# EAGLE schematic powerbox schematic v13 (EAGLE 9.7.0)
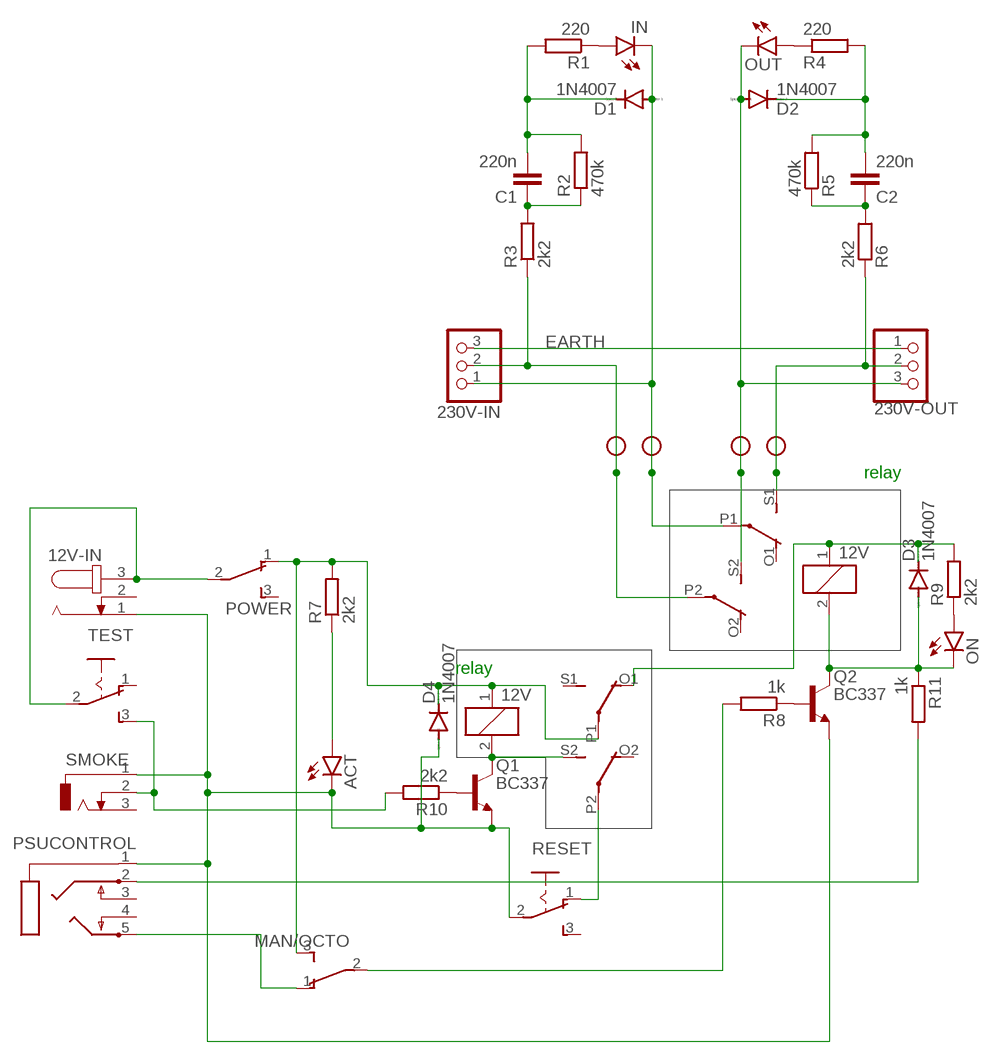
[diagram p0: schematic, sheet 1]

## Parts
12V-IN  JACK-PLUG0  [SPC4077]
230V-IN  PINHD-1X3  [1X03]
230V-OUT  PINHD-1X3  [1X03]
ACT  LED5MM  [LED5MM]
C1  220n  C-EU225-062X268  [C225-062X268]
C2  220n  C-EU225-062X268  [C225-062X268]
D1  1N4007  1N4004  [DO41-10]
D2  1N4007  1N4004  [DO41-10]
D3  1N4007  1N4004  [DO41-10]
D4  1N4007  1N4004  [DO41-10]
IN  LED5MM  [LED5MM]
K2  12V  4052  [F4052]
MAN/OCTO  TL36PO  [TL3XPO]
ON  LED5MM  [LED5MM]
OUT  LED5MM  [LED5MM]
POWER  TL36PO  [TL3XPO]
PSUCONTROL  PG203J  [PG203J]
Q1  BC337  NPN_TO92  [TO92]
Q2  BC337  NPN_TO92  [TO92]
R1  220  R-EU_VMTA55  [VMTA55]
R2  470k  R-EU_VMTA55  [VMTA55]
R3  2k2  R-EU_VMTA55  [VMTA55]
R4  220  R-EU_VMTA55  [VMTA55]
R5  470k  R-EU_VMTA55  [VMTA55]
R6  2k2  R-EU_VMTA55  [VMTA55]
R7  2k2  R-EU_VMTA55  [VMTA55]
R8  1k  R-EU_VMTA55  [VMTA55]
R9  2k2  R-EU_VMTA55  [VMTA55]
R10  2k2  R-EU_VMTA55  [VMTA55]
R11  1k  R-EU_VMTA55  [VMTA55]
RESET  255SB  [255SB]
SMOKE  DCJ0202  [DCJ0202]
SW  12V  4052  [F4052]
TEST  255SB  [255SB]
X2  W237-102  [W237-102]
X3  W237-102  [W237-102]

## Nets
EARTH: 230V-IN.3 230V-OUT.1
N$1: Q1.3(C) SW.2 SW.S2(3:S)
N$2: D3.A K2.2 ON.K(C) Q2.3(C) R11.1
N$3: C1.1 R2.1 R3.2
N$4: IN.A R1.1
N$5: C1.2 D1.C R1.2 R2.2
N$6: 230V-IN.1 D1.A IN.K(C) K2.P1(2:P) X2.1
N$7: 230V-IN.2 K2.P2(3:P) R3.1 X2.2
N$8: C2.1 R5.1 R6.2
N$9: OUT.A R4.1
N$10: C2.2 D2.C R4.2 R5.2
N$11: 230V-OUT.3 D2.A K2.S2(3:S) OUT.K(C) X3.2
N$12: 230V-OUT.2 K2.S1(2:S) R6.1 X3.1
N$13: D4.C MAN/OCTO.3(S) POWER.1(O) R7.2 SW.1 SW.P1(2:P)
N$14: ACT.A R7.1
N$15: RESET.1(O) SW.P2(3:P)
N$16: 12V-IN.3 POWER.2(P) TEST.2(P)
N$17: R10.2 SMOKE.2 TEST.3(S)
N$18: MAN/OCTO.1(O) PSUCONTROL.5
N$19: Q2.2(B) R8.1
N$20: MAN/OCTO.2(P) R8.2
N$21: ON.A R9.1
N$22: D3.C K2.1 R9.2 SW.O1(2:O)
N$23: 12V-IN.1 ACT.K(C) D4.A PSUCONTROL.1 Q1.1(E) Q2.1(E) RESET.2(P) SMOKE.1
N$24: Q1.2(B) R10.1
N$25: PSUCONTROL.2 R11.2
Unconnected: 12V-IN.2 K2.O1(2:O) K2.O2(3:O) POWER.3(S) PSUCONTROL.3 PSUCONTROL.4 RESET.3(S) SMOKE.3 SW.O2(3:O) SW.S1(2:S) TEST.1(O)

## Notes on the sheet
- relay
- relay

## Library data of the parts
12V-IN = con-jack:JACK-PLUG: DC POWER JACK Power Jack, DC, Right Angle, Through Hole, Rated 5A at 16VDC, PC Terminals Distributor: Farnell (www.Farnell.de) Drawing: 84N1161.pdf / 84N1162.pdf Manufacturer: SPC Technology (www.spctechnology.com) Type: SPC4077 / SPC 4078; OC_FARNELL: unknown; OC_NEWARK: unknown
230V-IN 230V-OUT = Connector:PINHD-1X3: PIN HEADER; CATEGORY: CONNECTOR; SUB-CATEGORY: PIN-HEADER
ACT IN ON OUT = led:LED: LED OSRAM: - CHIPLED LG R971, LG N971, LY N971, LG Q971, LY Q971, LO R971, LY R971 LH N974, LH R974 LS Q976, LO Q976, LY Q976 LO Q996 - Hyper CHIPLED LW Q18S LB Q993, LB Q99A, LB R99A - SideLED LS A670, LO A670, LY A670, LG A670, LP A670 LB A673, LV A673, LT A673, LW A673 LH A674 LY A675 LS A676, LA A676, LO A676, LY A676, LW A676 LS A679, LY A679, LG A679 - Hyper Micro SIDELED® LS Y876, LA Y876, LO Y876, LY Y876 LT Y87S - SmartLED LW L88C, LW L88S LB L89C, LB L89S, LG L890 LS L89K, LO L89K, LY L89K LS L896, LA L896, LO L896, LY L896 - TOPLED LS T670, LO T670, LY T670, LG T670, LP T670 LSG T670, LSP T670, LSY T670, LOP T670, LYG T670 LG T671, LOG T671, LSG T671 LB T673, LV T673, LT T673, LW T673 LH T674 LS T676, LA T676, LO T676, LY T676, LB T676, LH T676, LSB T676, LW T676 LB T67C, LV T67C, LT T67C, LS T67K, LO T67K, LY T67K, LW E67C LS E67B, LA E67B, LO E67B, LY E67B, LB E67C, LV E67C, LT E67C LW T67C LS T679, LY T679, LG T679 LS T770, LO T770, LY T770, LG T770, LP T770 LB T773, LV T773, LT T773, LW T773 LH T774 LS E675, LA E675, LY E675, LS T675 LS T776, LA T776, LO T776, LY T776, LB T776 LHGB T686 LT T68C, LB T68C - Hyper Mini TOPLED® LB M676 - Mini TOPLED Santana® LG M470 LS M47K, LO M47K, LY M47K Source: http://www.osram.convergy.de LUXEON: - LUMILED® LXK2-PW12-R00, LXK2-PW12-S00, LXK2-PW14-U00, LXK2-PW14-V00 LXK2-PM12-R00, LXK2-PM12-S00, LXK2-PM14-U00 LXK2-PE12-Q00, LXK2-PE12-R00, LXK2-PE12-S00, LXK2-PE14-T00, LXK2-PE14-U00 LXK2-PB12-K00, LXK2-PB12-L00, LXK2-PB12-M00, LXK2-PB14-N00, LXK2-PB14-P00, LXK2-PB14-Q00 LXK2-PR12-L00, LXK2-PR12-M00, LXK2-PR14-Q00, LXK2-PR14-R00 LXK2-PD12-Q00, LXK2-PD12-R00, LXK2-PD12-S00 LXK2-PH12-R00, LXK2-PH12-S00 LXK2-PL12-P00, LXK2-PL12-Q00, LXK2-PL12-R00 Source: www.luxeon.com KINGBRIGHT: KA-3528ASYC Source: www.kingbright.com
C1 C2 = rcl:C-EU: CAPACITOR, European symbol; SPICEPREFIX: C
D1-D4 = diode:1N4004: DIODE general purpose rectifier, 1 A
K2 SW = relay:4052: RELAY 2 x switch, Finder; OC_FARNELL: unknown; OC_NEWARK: unknown
MAN/OCTO POWER = switch:TL36PO: TINY SWITCH ON - ON Source: http://www2.produktinfo.conrad.com/datenblaetter/700000-724999/705152-da-01-de-Subminiaturschalter_TL_36YO.pdf
PSUCONTROL = con-hirschmann:PG203J: MIC/HEADPHONE JACK KS-S stereo microphone/headphone jack PG203JN (Schukat); OC_FARNELL: unknown; OC_NEWARK: unknown
Q1 Q2 = Transistor:NPN: NPN - Generic; CATEGORY: Transistor; SUB-CATEGORY: BJT; TYPE: NPN; VALUE: NPN
R1-R11 = rcl:R-EU_: RESISTOR, European symbol; SPICEPREFIX: R
RESET TEST = switch:255SB: SLIDING SWITCH Distributor Buerklin, 11G810
SMOKE = con-jack:DCJ0202: DC POWER JACK Source: DCJ0202.pdf; OC_FARNELL: unknown; OC_NEWARK: unknown
X2 X3 = con-wago-500:W237-102: WAGO SCREW CLAMP; MPN: 237-102; OC_FARNELL: unknown; OC_NEWARK: 70K9898